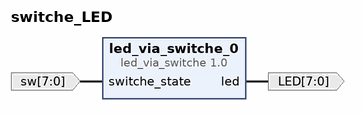
[diagram p0: block diagram of the top level]
# Vivado block design switche_LED, xc7a35tcpg236-1, Vivado 2025.1
create_bd_design switche_LED

create_bd_port -dir I -from 7 -to 0 -type data sw
create_bd_port -dir O -from 7 -to 0 -type data LED

create_bd_cell -type ip -vlnv xilinx.com:hls:led_via_switche:1.0 led_via_switche_0

# ---- connections ----

connect_bd_net [get_bd_pins led_via_switche_0/led] [get_bd_ports LED]
connect_bd_net -net switche_state_0_1 [get_bd_ports sw] [get_bd_pins led_via_switche_0/switche_state]

validate_bd_design
save_bd_design
